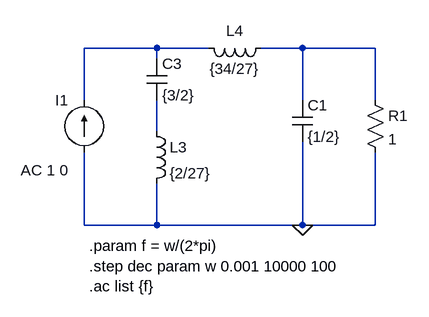
[diagram p0: schematic 2_Rev1.asc]
2_Rev1.asc, the LTspice schematic file:
Version 4
SHEET 1 932 680
WIRE -32 64 -144 64
WIRE 48 64 -32 64
WIRE 192 64 128 64
WIRE 304 64 192 64
WIRE -32 80 -32 64
WIRE -144 144 -144 64
WIRE 192 144 192 64
WIRE 304 144 304 64
WIRE -32 192 -32 144
WIRE -144 336 -144 224
WIRE -32 336 -32 272
WIRE -32 336 -144 336
WIRE 192 336 192 208
WIRE 192 336 -32 336
WIRE 304 336 304 224
WIRE 304 336 192 336
FLAG 192 336 0
SYMBOL cap -48 80 R0
SYMATTR InstName C3
SYMATTR Value {3/2}
SYMBOL ind -48 176 R0
SYMATTR InstName L3
SYMATTR Value {2/27}
SYMBOL ind 144 48 R90
WINDOW 0 5 56 VBottom 2
WINDOW 3 32 56 VTop 2
SYMATTR InstName L4
SYMATTR Value {34/27}
SYMBOL cap 176 144 R0
SYMATTR InstName C1
SYMATTR Value {1/2}
SYMBOL current -144 224 R180
WINDOW 0 24 80 Left 2
WINDOW 3 24 0 Left 2
WINDOW 123 24 -28 Left 2
WINDOW 39 0 0 Left 0
SYMATTR InstName I1
SYMATTR Value ""
SYMATTR Value2 AC 1 0
SYMBOL res 288 128 R0
SYMATTR InstName R1
SYMATTR Value 1
TEXT -136 368 Left 2 !.param f = w/(2*pi)\n.step dec param w 0.001 10000 100\n.ac list {f}

The netlist it stands for:
* 2_Rev1.asc
C3 N001 N003 {3/2}
L3 N003 0 {2/27}
L4 N002 N001 {34/27}
C1 N002 0 {1/2}
I1 0 N001 AC 1 0
R1 N002 0 1
.param f = w/(2*pi)
.step dec param w 0.001 10000 100
.ac list {f}
.backanno
.end